# Altium schematic sheet Sheet2.SchDoc
size A4
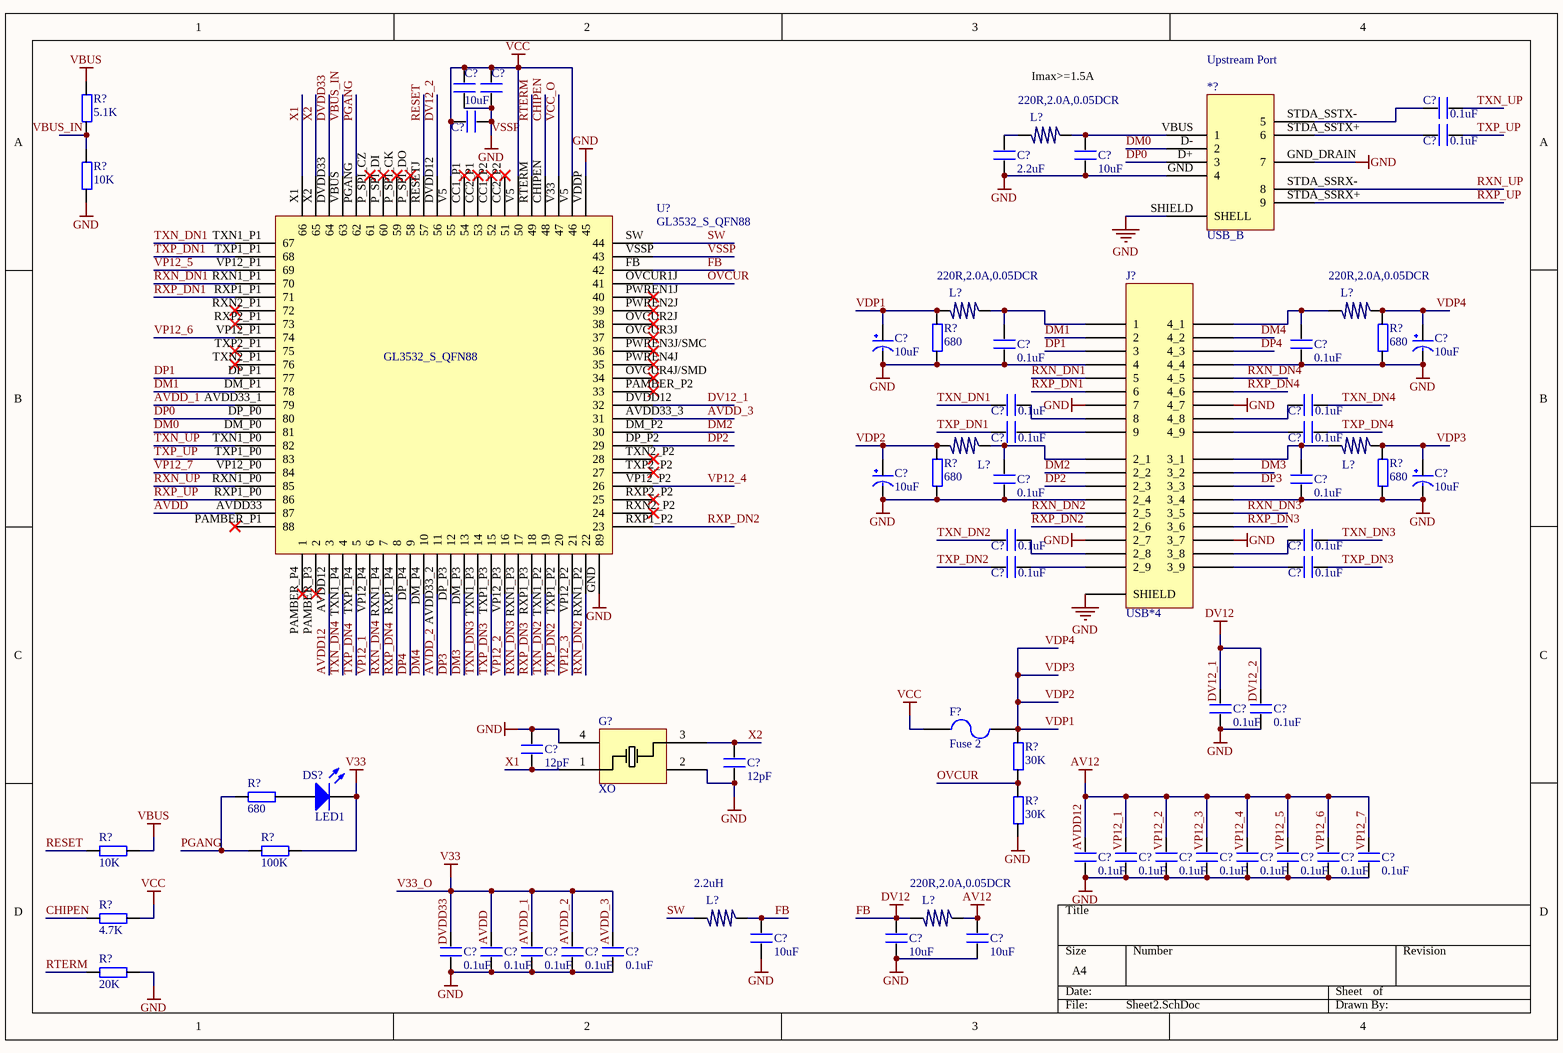
[diagram p0: Sheet2.SchDoc]

## Parts
(Parts that share a designator on the sheet are numbered #1, #2 ... from top to bottom, then left to right.)
*?  USB_B
C?#1  0.1uF  [0603P]
C?#2  10uF  [0603P]  (value not drawn)
C?#3  0.1uF  [0603P]
C?#4  10uF  [0603P]
C?#5  10uF  [0603P]  (value not drawn)
C?#6  2.2uF  [0603P]
C?#7  10uF  [0603P]
C?#8  0.1uF  [0603P]
C?#9  0.1uF  [0603P]
C?#10  10uF  [CC6.56.5]
C?#11  10uF  [CC6.56.5]
C?#12  0.1uF  [0603P]
C?#13  0.1uF  [0603P]
C?#14  0.1uF  [0603P]
C?#15  0.1uF  [0603P]
C?#16  0.1uF  [0603P]
C?#17  0.1uF  [0603P]
C?#18  10uF  [CC6.56.5]
C?#19  10uF  [CC6.56.5]
C?#20  0.1uF  [0603P]
C?#21  0.1uF  [0603P]
C?#22  0.1uF  [0603P]
C?#23  0.1uF  [0603P]
C?#24  0.1uF  [0603P]
C?#25  0.1uF  [0603P]
C?#26  12pF  [0603P]
C?#27  12pF  [0603P]
C?#28  0.1uF  [0603P]
C?#29  0.1uF  [0603P]
C?#30  0.1uF  [0603P]
C?#31  0.1uF  [0603P]
C?#32  0.1uF  [0603P]
C?#33  0.1uF  [0603P]
C?#34  0.1uF  [0603P]
C?#35  0.1uF  [0603P]
C?#36  10uF  [0603P]
C?#37  10uF  [0603P]
C?#38  10uF  [0603P]
C?#39  0.1uF  [0603P]
C?#40  0.1uF  [0603P]
C?#41  0.1uF  [0603P]
C?#42  0.1uF  [0603P]
C?#43  0.1uF  [0603P]
DS?  LED1  [SMDLED]
F?  Fuse 2  [PIN-W2/E2.8]
G?  XO
J?  USB*4
L?#1  220R,2.0A,0.05DCR  [0603P]
L?#2  220R,2.0A,0.05DCR  [0603P]
L?#3  220R,2.0A,0.05DCR  [0603P]
L?#4  220R,2.0A,0.05DCR  [0603P]  (value not drawn)
L?#5  220R,2.0A,0.05DCR  [0603P]  (value not drawn)
L?#6  2.2uH  [0603P]
L?#7  220R,2.0A,0.05DCR  [0603P]
R?#1  5.1K  [0603P]
R?#2  10K  [0603P]
R?#3  680  [0603P]
R?#4  680  [0603P]
R?#5  680  [0603P]
R?#6  680  [0603P]
R?#7  680  [0603P]
R?#8  10K  [0603P]
R?#9  100K  [0603P]
R?#10  4.7K  [0603P]
R?#11  20K  [0603P]
R?#12  30K  [0603P]
R?#13  30K  [0603P]
U?  GL3532_S_QFN88  [GL3532_S_QFN88]

## Nets
AV12: C?#28.2 C?#29.2 C?#30.2 C?#31.2 C?#32.2 C?#33.2 C?#34.2 C?#35.2 C?#38.2 L?#7.1
FB: C?#24.2 C?#25.2 C?#36.2 C?#37.2 L?#6.1 L?#7.2 U?.FB(42)  [also labelled DV12]
V33_O: C?#39.2 C?#40.2 C?#41.2 C?#42.2 C?#43.2 DS?.2(K) R?#9.2  [also labelled V33]
VBUS: R?#1.2 R?#8.2
VCC: C?#2.1 C?#4.2 C?#5.2 F?.1 R?#10.2 U?.V5(46)
VSSP: *?.GND(4) *?.GND_DRAIN(7) *?.SHIELD(SHELL) C?#2.2 C?#4.1 C?#5.1 C?#6.1 C?#7.1 C?#10.2(GND) C?#11.2(GND) C?#14.1 C?#15.1 C?#18.2(GND) C?#19.2(GND) C?#22.1 C?#23.1 C?#24.1 C?#25.1 C?#26.2 C?#27.1 C?#28.1 C?#29.1 C?#30.1 C?#31.1 C?#32.1 C?#33.1 C?#34.1 C?#35.1 C?#36.1 C?#37.1 C?#38.1 C?#39.1 C?#40.1 C?#41.1 C?#42.1 C?#43.1 G?.2 G?.4 J?.?4(4) J?.?7(7) J?.?13(2_4) J?.?16(2_7) J?.?22(4_4) J?.?25(4_7) J?.?31(3_4) J?.?34(3_7) J?.?37(SHIELD) R?#2.1 R?#3.1 R?#4.1 R?#5.1 R?#6.1 R?#11.2 R?#13.1 U?.GND(89) U?.VDDP(45) U?.VSSP(43)  [also labelled GND]
AVDD: U?.AVDD33(87)
AVDD12: U?.AVDD12(3)
AVDD_1: U?.AVDD33_1(79)
AVDD_2: U?.AVDD33_2(11)
AVDD_3: U?.AVDD33_3(31)
CHIPEN: R?#10.1 U?.CHIPEN(48)
DM0: *?.D-(2) U?.DM_P0(81)
DM1: J?.?2(2) U?.DM_P1(78)
DM2: J?.?11(2_2) U?.DM_P2(30)
DM3: J?.?29(3_2) U?.DM_P3(13)
DM4: J?.?20(4_2) U?.DM_P4(10)
DP0: *?.D+(3) U?.DP_P0(80)
DP1: J?.?3(3) U?.DP_P1(77)
DP2: J?.?12(2_3) U?.DP_P2(29)
DP3: J?.?30(3_3) U?.DP_P3(12)
DP4: J?.?21(4_3) U?.DP_P4(9)
DV12_1: U?.DVDD12(32)
DV12_2: U?.DVDD12(56)
DVDD33: U?.DVDD33(64)
OVCUR: R?#12.1 R?#13.2 U?.OVCUR1J(41)
PGANG: R?#7.1 R?#9.1 U?.PGANG(62)
RESET: R?#8.1 U?.RESETJ(57)
RTERM: R?#11.1 U?.RTERM(49)
RXN_DN1: J?.?5(5) U?.RXN1_P1(70)
RXN_DN2: J?.?14(2_5) U?.RXN1_P2(22)
RXN_DN3: J?.?32(3_5) U?.RXN1_P3(17)
RXN_DN4: J?.?23(4_5) U?.RXN1_P4(7)
RXN_UP: *?.STDA_SSRX-(8) U?.RXN1_P0(85)
RXP_DN1: J?.?6(6) U?.RXP1_P1(71)
RXP_DN2: J?.?15(2_6) U?.RXP1_P2(23)
RXP_DN3: J?.?33(3_6) U?.RXP1_P3(18)
RXP_DN4: J?.?24(4_6) U?.RXP1_P4(8)
RXP_UP: *?.STDA_SSRX+(9) U?.RXP1_P0(86)
SW: L?#6.2 U?.SW(44)
TXN_DN1: C?#8.1 U?.TXN1_P1(67)
TXN_DN2: C?#16.1 U?.TXN1_P2(19)
TXN_DN3: C?#17.2 U?.TXN1_P3(14)
TXN_DN4: C?#9.2 U?.TXN1_P4(4)
TXN_UP: C?#1.2 U?.TXN1_P0(82)
TXP_DN1: C?#12.1 U?.TXP1_P1(68)
TXP_DN2: C?#20.1 U?.TXP1_P2(20)
TXP_DN3: C?#21.2 U?.TXP1_P3(15)
TXP_DN4: C?#13.2 U?.TXP1_P4(5)
TXP_UP: C?#3.2 U?.TXP1_P0(83)
VBUS_IN: U?.VBUS(63)
VCC_O: U?.V33(47)
VDP1: C?#10.1(VCC) C?#11.1(VCC) C?#18.1(VCC) C?#19.1(VCC) F?.2 L?#2.2 L?#3.1 L?#4.2 L?#5.1 R?#3.2 R?#4.2 R?#5.2 R?#6.2 R?#12.2  [also labelled VDP2, VDP3, VDP4]
VP12_1: U?.VP12_P4(6)
VP12_2: U?.VP12_P3(16)
VP12_3: U?.VP12_P2(21)
VP12_4: U?.VP12_P2(26)
VP12_5: U?.VP12_P1(69)
VP12_6: U?.VP12_P1(74)
VP12_7: U?.VP12_P0(84)
X1: C?#26.1 G?.1 U?.X1(66)
X2: C?#27.2 G?.3 U?.X2(65)
Net*?_STDA_SSTX+: *?.STDA_SSTX+(6) C?#3.1
Net*?_STDA_SSTX-: *?.STDA_SSTX-(5) C?#1.1
Net*?_VBUS: *?.VBUS(1) C?#7.2 L?#1.1
NetC?#6_2: C?#6.2 L?#1.2
NetC?#8_2: C?#8.2 J?.?8(8)
NetC?#9_1: C?#9.1 J?.?26(4_8)
NetC?#12_2: C?#12.2 J?.?9(9)
NetC?#13_1: C?#13.1 J?.?27(4_9)
NetC?#14_2: C?#14.2 J?.?1(1) L?#2.1
NetC?#15_2: C?#15.2 J?.?19(4_1) L?#3.2
NetC?#16_2: C?#16.2 J?.?17(2_8)
NetC?#17_1: C?#17.1 J?.?35(3_8)
NetC?#20_2: C?#20.2 J?.?18(2_9)
NetC?#21_1: C?#21.1 J?.?36(3_9)
NetC?#22_2: C?#22.2 J?.?10(2_1) L?#4.1
NetC?#23_2: C?#23.2 J?.?28(3_1) L?#5.2
NetDS?_1: DS?.1(A) R?#7.2
NetR?#1_1: R?#1.1 R?#2.2

Not connected (* = marked no-connect by the designer): U? CC1_P1(54)* CC1_P2(52)* CC2_P1(53)* CC2_P2(51)* OVCUR2J(38)* OVCUR3J(37)* OVCUR4J/SMD(34)* P_SPI_CK(59)* P_SPI_CZ(61)* P_SPI_DI(60)* P_SPI_DO(58)* PAMBER_P1(88)* PAMBER_P2(33)* PAMBER_P3(2)* PAMBER_P4(1)* PWREN1J(40)* PWREN2J(39)* PWREN3J/SMC(36)* PWREN4J(35)* RXN2_P1(72)* RXN2_P2(24)* RXP2_P1(73)* RXP2_P2(25)* TXN2_P1(76)* TXN2_P2(28)* TXP2_P1(75)* TXP2_P2(27)*

## Notes on the sheet
- Imax>=1.5A
- Upstream Port
- Labels drawn without touching a wire or pin: AVDD, AVDD12, AVDD_1, AVDD_2, AVDD_3, DV12_1, DV12_2, DVDD33, VBUS_IN, VP12_1, VP12_2, VP12_3, VP12_4, VP12_5, VP12_6, VP12_7

## Library data of the parts
C?#1-C?#9 C?#12-C?#17 C?#20-C?#43 = C
C?#10 C?#11 C?#18 C?#19 = CAP
DS? = LED2: Typical RED, GREEN, YELLOW, AMBER GaAs LED; Published: 8-Jun-2000; LatestRevisionDate: 17-Jul-2002; LatestRevisionNote: Re-released for DXP Platform.; PackageDocument: Feb-2002; PackageReference: 3.2X1.6X1.1; Publisher: Altium Limited
F? = Fuse 2: Fuse; Published: 8-Jun-2000; LatestRevisionDate: 17-Jul-2002; LatestRevisionNote: Re-released for DXP Platform.; PackageReference: PIN-W2/E2.8; Publisher: Altium Limited; PackageDescription: Thru-Hole; 2 Leads
G? = XO: 25M XO
L?#1-L?#7 = L
R?#1-R?#13 = R